# Altium schematic sheet QuadDeck.SchDoc: Quad ToF Deck
size A4; Author: Vlad Niculescu; CompanyName: ETH Zürich; DrawnBy: Vlad Niculescu; Engineer: Vlad Niculescu; Organization: IIS/PBL; DocumentNumber: SLAM Project; Revision: A; SheetNumber: 1; SheetTotal: 1
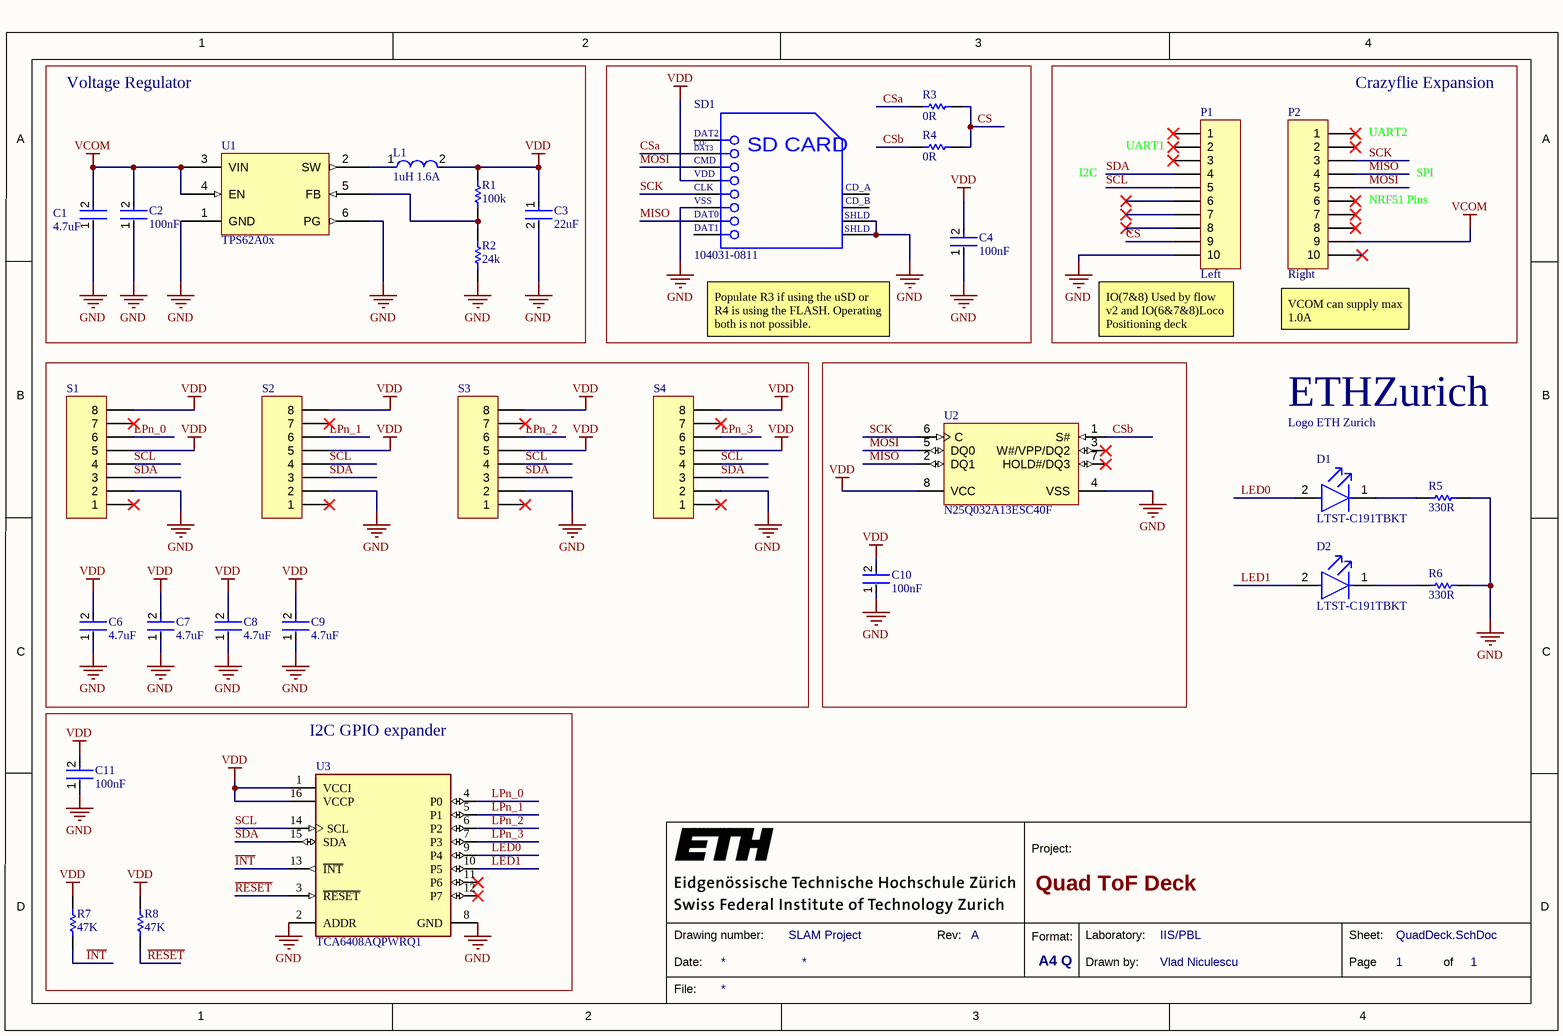
[diagram p0: QuadDeck.SchDoc]

## Parts
A1  Logo ETH Zurich  [eth-zurich_3mm]  (no BOM)
C1  4.7uF  [FP-GRM188-0_1-MFG]
C2  100nF  [FP-GRM15-MFG]
C3  22uF  [FP-GRM21B-0_15-MFG]
C4  100nF  [FP-GRM15-MFG]
C6  4.7uF  [FP-GRM188-0_1-MFG]
C7  4.7uF  [FP-GRM188-0_1-MFG]
C8  4.7uF  [FP-GRM188-0_1-MFG]
C9  4.7uF  [FP-GRM188-0_1-MFG]
C10  100nF  [FP-GRM15-MFG]
C11  100nF  [FP-GRM15-MFG]
D1  LTST-C191TBKT  [FP-LTST-C191TBKT-MFG]
D2  LTST-C191TBKT  [FP-LTST-C191TBKT-MFG]
L1  1uH 1.6A  [FP-LQM21PN_EH-w1_5-IPC_A]
P1  Left  [PCBComponent_1]
P2  Right  [PCBComponent_1]
R1  100k  [RESC1608X55X30ML20T20]
R2  24k  [RESC0603(1608)_N]
R3  0R  [RESC1005X40X25NL05T10]
R4  0R  [RESC1005X40X25NL05T10]
R5  330R  [RESC1608X55X25NL10T15]
R6  330R  [RESC1608X55X25NL10T15]
R7  47K  [RESC1608X55X30NL15T15]
R8  47K  [RESC1608X55X30NL15T15]
S1  Header  [tof-connector]  (value not drawn)
S2  Header  [tof-connector]  (value not drawn)
S3  Header  [tof-connector]  (value not drawn)
S4  Header  [tof-connector]  (value not drawn)
SD1  104031-0811  [MOLX-104031-0811_V]
U1  TPS62A0x  [SOT50P245X110-6N]
U2  N25Q032A13ESC40F  [MICT-SC-8_N]
U3  TCA6408AQPWRQ1  [FP-PW0016A-IPC_B]

## Blocks framed on the sheet
Voltage Regulator: C1-C3 L1 R1 R2 U1
Crazyflie Expansion: P1 P2
I2C GPIO expander: C11 R7 R8 U3

## Nets
GND: C1.1 C2.1 C3.2 C4.1 C6.1 C7.1 C8.1 C9.1 C10.1 C11.1 P1.10 R2.1 R5.2 R6.2 S1.2 S2.2 S3.2 S4.2 SD1.6(VSS2) SD1.11(SHLD1) SD1.12(SHLD2) U1.1(GND) U1.6(PG) U2.4(VSS) U3.2(ADDR) U3.8(GND)
VCOM: C1.2 C2.2 P2.9 U1.3(VIN) U1.4(EN)
VDD: C3.1 C4.2 C6.2 C7.2 C8.2 C9.2 C10.2 C11.2 L1.2 R1.2 R7.2 R8.2 S1.5 S1.8 S2.5 S2.8 S3.5 S3.8 S4.5 S4.8 SD1.4(VDD) U2.8(VCC) U3.1(VCCI) U3.16(VCCP)
~{INT}: R7.1 U3.13(~{INT})
~{RESET}: R8.1 U3.3(~{RESET})
CS: P1.9 R3.2 R4.2
CSa: R3.1 SD1.2(CMD)
CSb: R4.1 U2.1(S#)
LED0: D1.2(A) U3.9(P4)
LED1: D2.2(A) U3.10(P5)
LPn_0: S1.6 U3.4(P0)
LPn_1: S2.6 U3.5(P1)
LPn_2: S3.6 U3.6(P2)
LPn_3: S4.6 U3.7(P3)
MISO: P2.4 SD1.7(DAT0) U2.2(DQ1)
MOSI: P2.5 SD1.3(VSS1) U2.5(DQ0)
SCK: P2.3 SD1.5(CLK) U2.6(C)
SCL: P1.5 S1.4 S2.4 S3.4 S4.4 U3.14(SCL)
SDA: P1.4 S1.3 S2.3 S3.3 S4.3 U3.15(SDA)
NetD1_1: D1.1(C) R5.1
NetD2_1: D2.1(C) R6.1
NetL1_1: L1.1 U1.2(SW)
NetR1_1: R1.1 R2.2 U1.5(FB)

Not connected (* = marked no-connect by the designer): P1 1* 2* 3* 6* 7* 8*; P2 1* 2* 6* 7* 8* 10*; S1 1* 7*; S2 1* 7*; S3 1* 7*; S4 1* 7*; SD1 1(CD/DAT3) 8(DAT1) 9(CD_A) 10(CD_B); U2 3(W#/VPP/DQ2)* 7(HOLD#/DQ3)*; U3 11(P6)* 12(P7)*

## Notes on the sheet
- I2C
- (near P1) UART1
- (near P2) UART2
- SPI
- (near P2) NRF51 Pins
- (near SD1) Populate R3 if using the uSD or R4 is using the FLASH. Operating both is not possible.
- (near P1) IO(7&8) Used by flow v2 and IO(6&7&8)Loco Positioning deck
- (near P2) VCOM can supply max 1.0A
- 1
- 2
- 3
- 4
- A
- B
- C
- Project:
- D
- Date:
- Drawing number:
- Rev:
- Format:
- A4 Q
- Drawn by:
- Laboratory:
- Page
- Sheet:
- of
- File:
- (in symbol CMP-00038-1) ETHZurich
- (in symbol CMP-2000-05825-1) DAT2; CD/; DAT3; SD CARD; VSS; SHLD

## Library data of the parts
A1 = CMP-00038-1
C1 C6-C9 = CMP-2006-02799-3: CAP CER 4.7UF 6.3V X5R 0603; Material: Ceramic; Tolerance: 10%; Max Operating Temperature: 85°C; REACH SVHC: No SVHC; Thickness: 0.035inch; Voltage Rating: 6.3V; Package Quantity: 1; Radiation Hardening: No; Capacitance: 4.7uF; Voltage: 6.3V; Case Code (Metric): 1608; Dielectric: X5R; Mount: Surface Mount; RoHS Compliant: Yes; Height: 0.8mm; Voltage Rating (DC): 6.3V; Width: 0.8mm; Lead Free: Lead Free; Case Code (Imperial): 0603; Packaging: Tape and Reel; Length: 1.6mm; Case/Package: 0603; Termination: SMD/SMT; Min Operating Temperature: -55°C; Depth: 0.8mm
C2 C4 C10 C11 = CMP-2100-03641-2: CAP CER 0.1UF 16V X7R 0402; Manufacturer Part Number: GRM155R71C104KA88D; Manufacturer: Murata; Standoff Height: 0mm; Tolerance: 10%; Voltage Rating: 16Vdc; Material: Ceramic; Capacitance: 0.10μF; Value: 0.10μF; RoHS: TRUE; Temperature Characteristic: X7R; Octopart: https://octopart.com/grm155r71c104ka88d-murata-196880; Digikey Description: CAP CER 0.1UF 16V X7R 0402; Device Class L3: Ceramic Capacitors; Height: 0.55mm; ComponentLink2Description: Datasheet; Temperature Range Low: -55°C; Ipc Land Pattern Name: CAPC10050X219; ComponentLink2URL: https://search.murata.co.jp/Ceramy/image/img/A01X/G101/ENG/GRM155R71H471KA01-01A.pdf; Device Class L1: Passive Components; Lead Free: yes; Category: Cap; Package: GRM15; Temperature: -55°C to +125°C; Device Class L2: Capacitors; Temperature Range High: +125°C; Mouser Description: 0402 0.1 uF 16V ±10 % Tolerance X7R SMT Multilayer Ceramic Capacitor
C3 = CMP-2007-03385-2: Chip Multilayer Ceramic Capacitors for General Purpose, 0805, 22uF, X5R, 15%, 20%, 6.3V; Material: Ceramic; Max Operating Temperature: 85°C; Voltage: 6.3V; Min Operating Temperature: -55°C; Case/Package: 0805; Thickness: 0.053inch; Dielectric: X5R; Packaging: Tape and Reel; Depth: 1.25mm; Termination: SMD/SMT; Voltage Rating (DC): 6.3V; Radiation Hardening: No; Tolerance: 20%; Mount: Surface Mount; Lead Free: Lead Free; Package Quantity: 1; REACH SVHC: No SVHC; Voltage Rating: 6.3V; Capacitance: 22uF; Length: 2mm; Case Code (Imperial): 0805; Case Code (Metric): 2012; Width: 0.049inch; Height: 1.25mm
D1 D2 = CMP-22017-000008-1: LED BLUE CLEAR CHIP SMD; Lens Color: Colorless; Dominant Wavelength: 475nm; Forward Current: 20mA; Wavelength: 468nm; Viewing Angle: 130°; Power Dissipation: 76mW; Luminous Intensity: 180mcd; Reverse Voltage: 5V; Number of Elements: 1; Lens Style: Diffused; Forward Voltage: 3.8V; Max Power Dissipation: 75mW; Case Code (Metric): 1608; Packaging: Tape and Reel; Case/Package: 0603; Depth: 1.6mm; Mount: Surface Mount; Lead Free: Lead Free; Min Operating Temperature: -20°C; Lens Transparency: Clear; Illumination Color: Blue; Height: 0.55mm; Test Current: 20mA; Case Code (Imperial): 0603; Max Operating Temperature: 80°C; Number of Pins: 2; Length: 0.8mm; Radiation Hardening: No; Package Quantity: 1; Number of LEDs: 1; Width: 0.8mm; Color: Blue
L1 = CMP-06042-012339-2: FIXED IND 1UH 1.6A 107 MOHM SMD; Core Material: Ferrite; DC Resistance (DCR): 107mR; Saturation Current: 1A; Self Resonant Frequency: 50MHz; Test Frequency: 1MHz; Tolerance: 20%; Shielding: Shielded; Packaging: Tape and Reel; Max Operating Temperature: 85°C; Case Code (Metric): 2012; Case Code (Imperial): 0805; Mount: Surface Mount; RoHS Compliant: Yes; Current Rating: 1.6A; Inductance: 1uH; Min Operating Temperature: -40°C; Case/Package: 0805
P1 P2 = MHDR1X10: Header, 10-Pin; LatestRevisionDate: 17-Jul-2002; LatestRevisionNote: Re-released for DXP Platform.; Publisher: Altium Limited
R1 = CMP-2000-00875-1: Part Number: ERA3AEB104V; Manufacturer: Panasonic
R2 = CMP-1012-00107-1: 24K 0.1W 5% 0603 (1608 Metric)  SMD; Case-Metric: 1608; Case-EIA: 0603; Value: 24000.00 Ohm; Tolerance: 5 %; Technology: SMT; Power: 0.1 W
R3 R4 = CMP-1011-00001-2: Manufacturer: Yageo / Phycomp; Part Number: RC0402JR-070RL
R5 R6 = CMP-1659-00020-2: Chip Resistor, 330 Ohm, +/- 1%, 0.1 W, -55 to 155 degC, 0603 (1608 Metric), RoHS, Tape and Reel; Tolerance: 10%; ESR: 800 mohm; Voltage Rating (DC): 16 V; Capacitance: 47 uF; Length: 7.3 mm; ComponentLink1URL: http://www.yageo.com/; Packaging: Tape and Reel; Pins: 2; ComponentLink1Description: Manufacturer URL; Case Code (Imperial): 2917; REACH SVHC: No SVHC; Width: 4.3 mm; ComponentLink2Description: Datasheet; Voltage Rating: 16 V; RoHSCompliant: True; Max Operating Temperature: 125degC; ComponentLink2URL: http://www.yageo.com/documents/recent/PYu-RC_Group_51_RoHS_L_04.pdf; Min Operating Temperature: -55degC; Case/Package: 2917; Radiation Hardening: No; DatasheetVersion: Rev. 4, 02/2016; Mount: Surface Mount; PackageReference: 0603; Package Quantity: 500; Case Code (Metric): 7343; PackageDescription: 2-Pin Surface Mount Device, Body 1.6 x 0.8 mm; Height: 3.1 mm
R7 R8 = CMP-2000-00523-2: Chip Resistor, 47 KOhm, +/- 1%, 0.1 W, -55 to 155 degC, 0603 (1608 Metric), RoHS, Tape and Reel; Case\Package: 0603; Forward Current: 20 mA; Power Rating: 90 mW; Illumination Colour: Red; Nominal Vf: 2.1 V; Viewing Angle: 160 degrees; Luminous Intensity: 63 mcd; Lens Style: Clear; Nominal Wavelength: 639 nm; Case Code (Imperial): 0603; Case Code (Metric): 1608; Packaging: Tape and Reel; Radiation Hardening: No; Colour: Red; PackageDescription: 2-Pin Surface Mount Device, Body 1.6 x 0.85 mm; ComponentLink1Description: Manufacturer URL; Width: 0.8 mm; DatasheetVersion: Apr-15; ComponentLink2URL: http://industrial.panasonic.com/cdbs/www-data/pdf/RDA0000/AOA0000C86.pdf; Min Operating Temperature: -40 degC; Height: 0.6 mm; Package Quantity: 3000; ComponentLink2Description: Datasheet; REACH SVHC: No SVHC; ComponentLink1URL: http://www.panasonic.com/; Mount: Surface Mount; RoHSCompliant: true; Max Operating Temperature: 100 degC; PackageReference: 0603; Length: 1.6 mm; Forward Voltage: 2.1 V; Pins: 2
S1-S4 = Header 8: Header, 8-Pin; LatestRevisionDate: 17-Jul-2002; LatestRevisionNote: Re-released for DXP Platform.; Publisher: Altium Limited
SD1 = CMP-2000-05825-1: Micro SD Card, RA, -25 to 85 degC, 8-Pin SMD, RoHS, Tape and Reel; Voltage Rating: 10VAC/DC; Number of Contacts: 8; Insertion - Extraction Style: Push-Pull; Pitch: 1.1mm; Mating Cycles: 10000; Brand: Molex; Current Rating: 500mA; Manufacturer URL: http://www.molex.com/; Card Type: microSD; Mounting Type: Standard; Height: 1.42mm; Mounting Technology: SurfaceMount; Contact Plating: Gold; Product Category: MemoryCardConnectors; Package Description: 8-Pin Surface Mount Device, Body 11.95 x 11.4 mm, Pitch 1.1 mm; Datasheet URL: http://www.molex.com/pdm_docs/sd/1040310811_sd.pdf; Termination Style: SMD; Length: 11.4mm; Housing Material: LiquidCrystalPolymer(LCP); Orientation: RightAngle; RoHS: True; Contact Material: PhosphorBronze; Datasheet Version: Rev. E, 04/2006; Packaging: Reel; Manufacturer: Molex; Series: 104031; Product: CardConnectors; Number of Rows: 1Row; Package Reference: 104031-0811
U1 = TPS62A01
U2 = CMP-0357-00152-1: 32 Mb (x1/x2/x4) Serial NOR Flash Memory with Multi I/O, 108 MHz, 2.7 to 3.6 V, 8-pin SO8 Narrow (SC), Tape & Reel; Manufacturer: Micron; Part Family: N25QÂ; Density: 32MbÂ; Speed: 108 MHzÂ; Voltage: 2.7V-3.6VÂ; PackageReference: MICT-SC-8; Width: x1/x2/x4Â; Mounting Technology: Surface Mount; ComponentLink2Description: Datasheet; PackageVersion: Rev. E; ComponentLink1Description: Manufacturer URL; PackageDescription: 8-Pin SO Narrow, 3.9 X 4.9 mm, Pitch 1.27 mm; ComponentLink2URL: http://www.micron.com/~/media/Documents/Products/Data%20Sheet/NOR%20Flash/Serial%20NOR/N25Q/n25q_32mb_3v_65nm.pdf; Part Status: ProductionÂ; Applications: EmbeddedÂ; ComponentLink1URL: http://www.micron.com/; PartNumber: N25Q032A13ESC40F; ComponentLink3Description: Package Specification; ComponentLink3URL: http://www.micron.com/~/media/Documents/Products/Data%20Sheet/NOR%20Flash/Serial%20NOR/N25Q/n25q_32mb_3v_65nm.pdf; Package: SO8 NarrowÂ; Type: Multi I/OÂ; DatasheetVersion: Rev. G; RoHS: YesÂ
U3 = CMP-04886-000007-1: IC I/O EXPANDER I2C 8B 16TSSOP; Number of I/Os: 8; Lead Free: Lead Free; Min Operating Temperature: -40°C; Case/Package: TSSOP; RoHS Compliant: Yes; Max Operating Temperature: 125°C